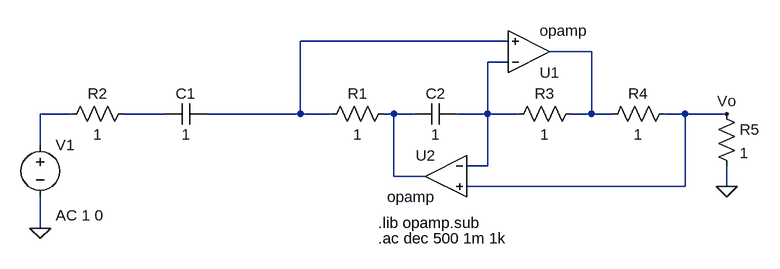
[diagram p0: schematic punto4.asc]
punto4.asc, the LTspice schematic file:
Version 4.1
SHEET 1 968 756
WIRE 576 256 256 256
WIRE 704 272 640 272
WIRE 576 288 544 288
WIRE -96 368 -144 368
WIRE 48 368 -16 368
WIRE 256 368 256 256
WIRE 256 368 112 368
WIRE 304 368 256 368
WIRE 400 368 384 368
WIRE 432 368 400 368
WIRE 544 368 544 288
WIRE 544 368 496 368
WIRE 592 368 544 368
WIRE 704 368 704 272
WIRE 704 368 672 368
WIRE 736 368 704 368
WIRE 848 368 816 368
WIRE 912 368 848 368
WIRE -144 416 -144 368
WIRE 544 448 544 368
WIRE 544 448 512 448
WIRE 400 464 400 368
WIRE 448 464 400 464
WIRE 848 480 848 368
WIRE 848 480 512 480
WIRE 912 480 912 448
WIRE -144 544 -144 496
FLAG 912 480 0
FLAG -144 544 0
FLAG 912 368 Vo
SYMBOL res 400 352 R90
WINDOW 0 0 56 VBottom 2
WINDOW 3 32 56 VTop 2
SYMATTR InstName R1
SYMATTR Value 1
SYMBOL res 688 352 R90
WINDOW 0 0 56 VBottom 2
WINDOW 3 32 56 VTop 2
SYMATTR InstName R3
SYMATTR Value 1
SYMBOL res 832 352 R90
WINDOW 0 0 56 VBottom 2
WINDOW 3 32 56 VTop 2
SYMATTR InstName R4
SYMATTR Value 1
SYMBOL res 896 352 R0
SYMATTR InstName R5
SYMATTR Value 1
SYMBOL cap 496 352 R90
WINDOW 0 0 32 VBottom 2
WINDOW 3 32 32 VTop 2
SYMATTR InstName C2
SYMATTR Value 1
SYMBOL OpAmps\\opamp 608 336 M180
SYMATTR InstName U1
SYMBOL OpAmps\\opamp 480 400 M0
SYMATTR InstName U2
SYMBOL res 0 352 R90
WINDOW 0 0 56 VBottom 2
WINDOW 3 32 56 VTop 2
SYMATTR InstName R2
SYMATTR Value 1
SYMBOL cap 112 352 R90
WINDOW 0 0 32 VBottom 2
WINDOW 3 32 32 VTop 2
SYMATTR InstName C1
SYMATTR Value 1
SYMBOL voltage -144 400 R0
WINDOW 123 24 124 Left 2
WINDOW 39 0 0 Left 0
SYMATTR Value2 AC 1 0
SYMATTR InstName V1
SYMATTR Value ""
TEXT 376 536 Left 2 !.lib opamp.sub
TEXT 376 560 Left 2 !.ac dec 500 1m 1k

The netlist it stands for:
* punto4.asc
R1 N006 N001 1
R3 N002 N003 1
R4 Vo N002 1
R5 Vo 0 1
C2 N003 N006 1
X§U1 N003 N001 N002 opamp Aol=100K GBW=10Meg  ; pins invin noninvin out
X§U2 N003 Vo N006 opamp Aol=100K GBW=10Meg  ; pins invin noninvin out
R2 N005 N004 1
C1 N001 N005 1
V1 N004 0 AC 1 0
.lib opamp.sub
.ac dec 500 1m 1k
.backanno
.end